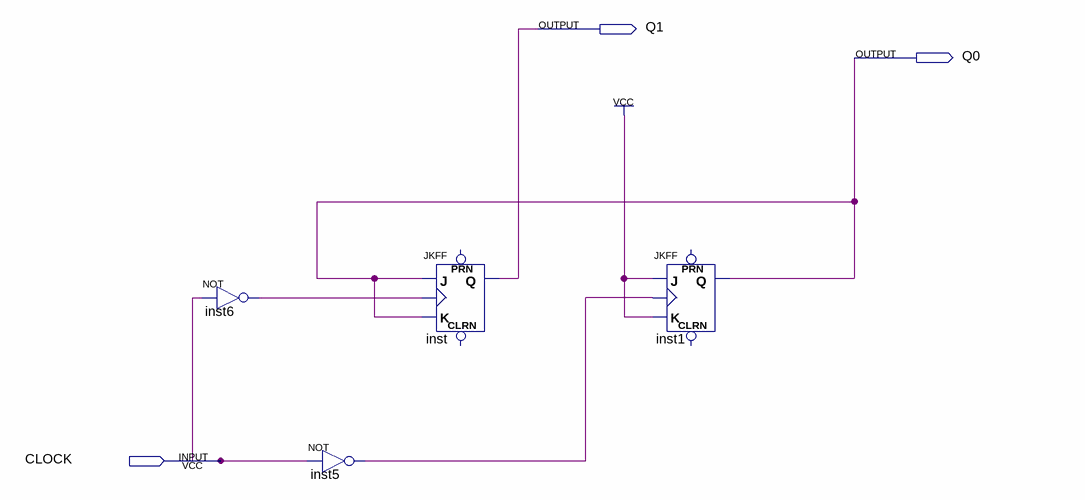
[diagram p0: schematic sheet]
// Quartus schematic contador0a3.bdf as structural Verilog: 4 symbols, 3 pins
module contador0a3 (
  input  CLOCK,
  output Q1,
  output Q0
);

  wire inst5_out, inst6_out;

  not inst6 (inst6_out, CLOCK);
  not inst5 (inst5_out, CLOCK);
  JKFF inst (.K(Q0), .J(Q0), .CLK(inst6_out), .Q(Q1));  // open: PRN, CLRN
  JKFF inst1 (.K(1'b1), .J(1'b1), .CLK(inst5_out), .Q(Q0));  // open: PRN, CLRN
endmodule
